# Altium schematic sheet Motor-X.SchDoc: Motor-X
size Letter; DocumentNumber: 3; SheetNumber: 5; SheetTotal: 11
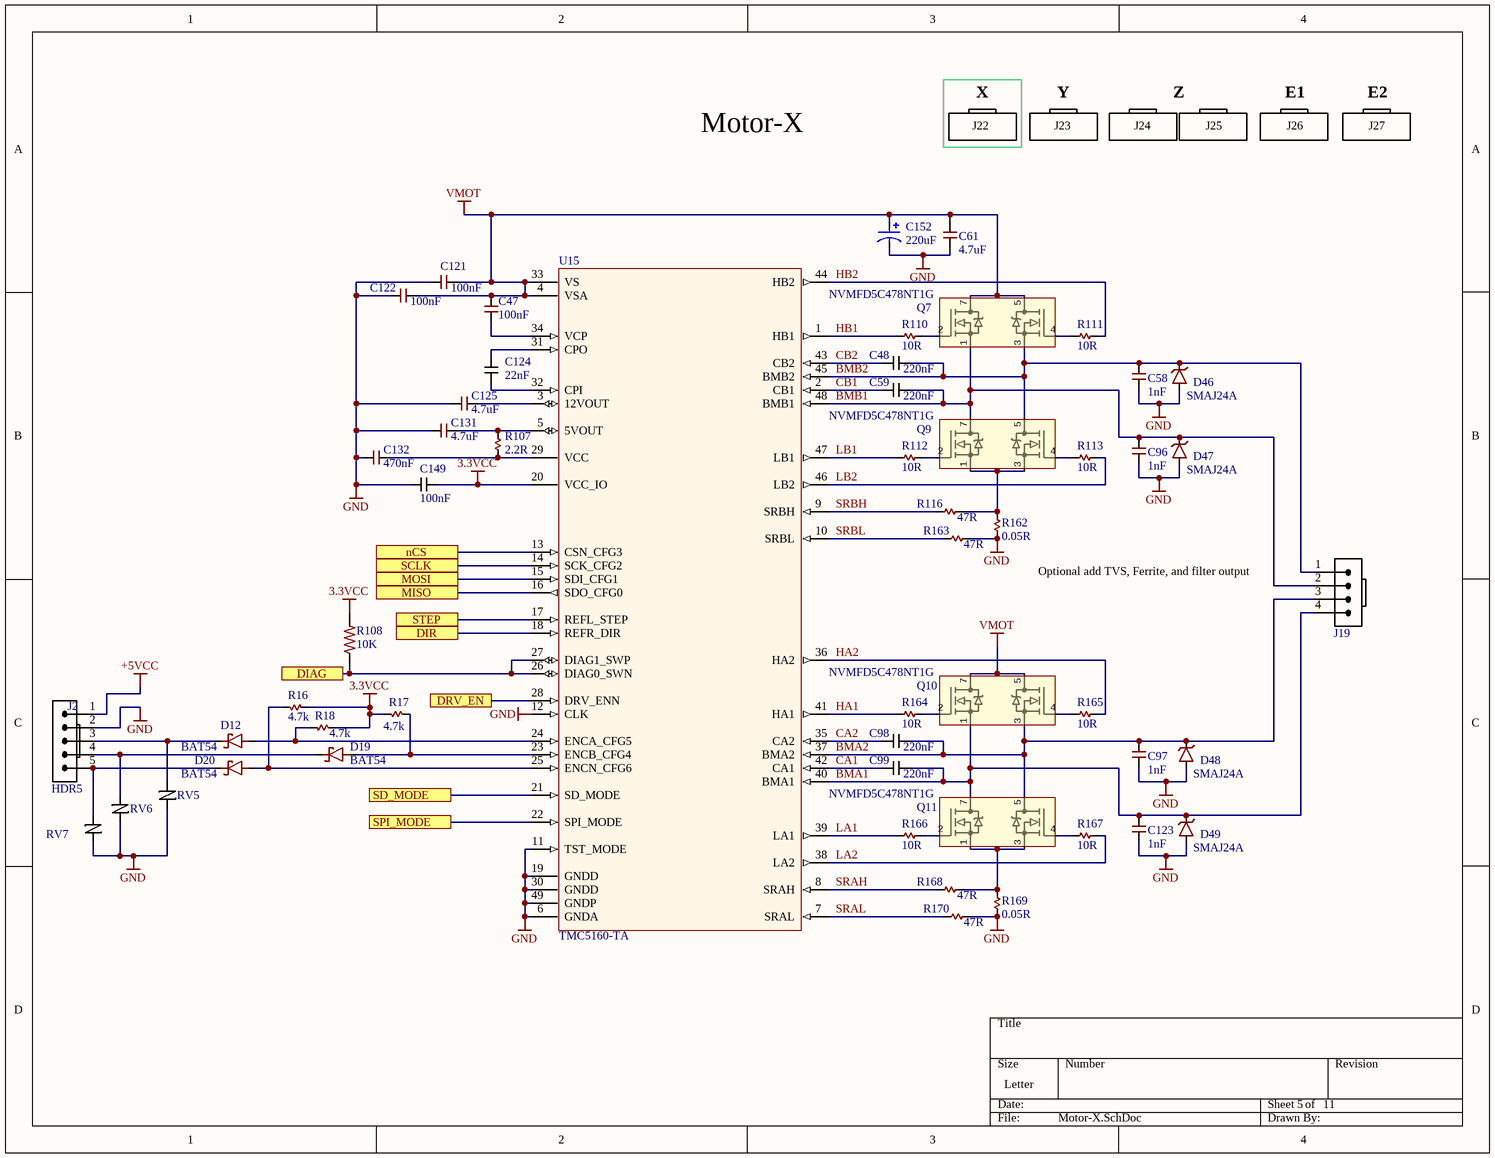
[diagram p0: Motor-X.SchDoc]

## Parts
C47  100nF  [C0603]
C48  220nF  [C0603]
C58  1nF  [C0603]
C59  220nF  [C0603]
C61  4.7uF  [C1206]
C96  1nF  [C0603]
C97  1nF  [C0603]
C98  220nF  [C0603]
C99  220nF  [C0603]
C121  100nF  [C0603]
C122  100nF  [C0603]
C123  1nF  [C0603]
C124  22nF  [C0603]
C125  4.7uF  [C1206]
C131  value 4.7uF  [C0603]  (hidden comment: 4.7uF 6.3V 0603)
C132  value 470nF  [C0402]  (hidden comment: 0402)
C149  100nF  [C0201 Large Pads]
C152  220uF  [CAP10X10]
D12  BAT54  [SOD523_IPC]
D19  BAT54  [SOD523_IPC]
D20  BAT54  [SOD523_IPC]
D46  SMAJ24A  [SMA-SM]
D47  SMAJ24A  [SMA-SM]
D48  SMAJ24A  [SMA-SM]
D49  SMAJ24A  [SMA-SM]
J2  value HDR5  [70543-04_PIN-IN-PASTE]  (hidden comment: Molex 70543-04)
J19  Molex 0705430003  [4POL254 PIN-IN-PASTE]  (value not drawn)
Q7  NVMFD5C478NT1G  [SO8FL-Dual (DFN8 5x6, 1.26P Dual Flag)]
Q9  NVMFD5C478NT1G  [SO8FL-Dual (DFN8 5x6, 1.26P Dual Flag)]
Q10  NVMFD5C478NT1G  [SO8FL-Dual (DFN8 5x6, 1.26P Dual Flag)]
Q11  NVMFD5C478NT1G  [SO8FL-Dual (DFN8 5x6, 1.26P Dual Flag)]
R16  4.7k  [R0402]
R17  4.7k  [R0402]
R18  4.7k  [R0402]
R107  2.2R  [R0402]
R108  10K  [R0402]
R110  10R  [R0402]
R111  10R  [R0402]
R112  10R  [R0402]
R113  10R  [R0402]
R116  47R  [R0402]
R162  0.05R  [R2512]
R163  47R  [R0402]
R164  10R  [R0402]
R165  10R  [R0402]
R166  10R  [R0402]
R167  10R  [R0402]
R168  47R  [R0402]
R169  0.05R  [R2512]
R170  47R  [R0402]
RV5  AVRM0603C6R8NT101N  [C0201 Large Pads]  (value not drawn)
RV6  AVRM0603C6R8NT101N  [C0201 Large Pads]  (value not drawn)
RV7  AVRM0603C6R8NT101N  [C0201 Large Pads]  (value not drawn)
U15  TMC5160-TA  [TQFP48-EP]

## Ports
DIAG, DIR, DRV_EN, MISO, MOSI, nCS, SCLK, SD_MODE, SPI_MODE, STEP

## Nets
3.3VCC: C149.2 R16.2 R17.1 R18.2 R108.2 U15.20(VCC_IO)
+5VCC: J2.1
GND: C58.1 C61.1 C96.1 C97.1 C121.1 C122.1 C123.1 C125.1 C131.1 C132.1 C149.1 C152.2 D46.A D47.A D48.A D49.A J2.2 R162.1 R163.2 R169.1 R170.2 RV5.2 RV6.2 RV7.2 U15.6(GNDA) U15.11(TST_MODE) U15.12(CLK) U15.19(GNDD) U15.30(GNDD) U15.49(GNDP)
VMOT: C47.2 C61.2 C121.2 C122.2 C152.1 Q7.5(D1) Q7.7(D2) Q10.5(D1) Q10.7(D2) U15.4(VSA) U15.33(VS)
BMA1: C99.2 C123.2 D49.K J19.4 Q10.1(S2) Q11.7(D2) U15.40(BMA1)
BMA2: C97.2 C98.2 D48.K J19.3 Q10.3(S1) Q11.5(D1) U15.37(BMA2)
BMB1: C59.2 C96.2 D47.K J19.2 Q7.1(S2) Q9.7(D2) U15.48(BMB1)
BMB2: C48.2 C58.2 D46.K J19.1 Q7.3(S1) Q9.5(D1) U15.45(BMB2)
CA1: C99.1 U15.42(CA1)
CA2: C98.1 U15.35(CA2)
CB1: C59.1 U15.2(CB1)
CB2: C48.1 U15.43(CB2)
DIAG: R108.1 U15.26(DIAG0_SWN) U15.27(DIAG1_SWP) ; port DIAG
DIR: U15.18(REFR_DIR) ; port DIR
DRV_EN: U15.28(DRV_ENN) ; port DRV_EN
HA1: R164.1 U15.41(HA1)
HA2: R165.2 U15.36(HA2)
HB1: R110.1 U15.1(HB1)
HB2: R111.2 U15.44(HB2)
LA1: R166.1 U15.39(LA1)
LA2: R167.2 U15.38(LA2)
LB1: R112.1 U15.47(LB1)
LB2: R113.2 U15.46(LB2)
MISO: U15.16(SDO_CFG0) ; port MISO
MOSI: U15.15(SDI_CFG1) ; port MOSI
nCS: U15.13(CSN_CFG3) ; port nCS
SCLK: U15.14(SCK_CFG2) ; port SCLK
SD_MODE: U15.21(SD_MODE) ; port SD_MODE
SPI_MODE: U15.22(SPI_MODE) ; port SPI_MODE
SRAH: R168.1 U15.8(SRAH)
SRAL: R170.1 U15.7(SRAL)
SRBH: R116.1 U15.9(SRBH)
SRBL: R163.1 U15.10(SRBL)
STEP: U15.17(REFL_STEP) ; port STEP
NetC47_1: C47.1 U15.34(VCP)
NetC124_1: C124.1 U15.32(CPI)
NetC124_2: C124.2 U15.31(CPO)
NetC125_2: C125.2 U15.3(12VOUT)
NetC131_2: C131.2 R107.2 U15.5(5VOUT)
NetC132_2: C132.2 R107.1 U15.29(VCC)
NetD12_A: D12.A R18.1 U15.24(ENCA_CFG5)
NetD12_K: D12.K J2.3 RV5.1
NetD19_A: D19.A R17.2 U15.23(ENCB_CFG4)
NetD19_K: D19.K J2.4 RV6.1
NetD20_A: D20.A R16.1 U15.25(ENCN_CFG6)
NetD20_K: D20.K J2.5 RV7.1
NetQ7_2: Q7.2(G2) R110.2
NetQ7_4: Q7.4(G1) R111.1
NetQ9_1: Q9.1(S2) Q9.3(S1) R116.2 R162.2
NetQ9_2: Q9.2(G2) R112.2
NetQ9_4: Q9.4(G1) R113.1
NetQ10_2: Q10.2(G2) R164.2
NetQ10_4: Q10.4(G1) R165.1
NetQ11_1: Q11.1(S2) Q11.3(S1) R168.2 R169.2
NetQ11_2: Q11.2(G2) R166.2
NetQ11_4: Q11.4(G1) R167.1

## Notes on the sheet
- X
- Y
- Z
- E1
- E2
- Motor-X
- J22
- J23
- J24
- J25
- J26
- J27
- (near J19) Optional add TVS, Ferrite, and filter output

## Library data of the parts
C47 C121 C122 = 100nF 0603 50V X7R: CAP CER 0603 100nF 50V 10% X7R; MANUFACTURER: Kemet; MANUFACTURER #: C0603C104K5RACTU; PART: 100nF 50V X7R 0603; PART DESCRIPTION: 0.10µF ±10% 50V Ceramic Capacitor X7R 0603 (1608 Metric); DISTRIBUTOR #: 399-5089-2-ND; DISTRIBUTOR: Digikey; TOLERANCE: 10%; EE_SPEC: 50V; VALUE: 100nF
C48 C59 C98 C99 = 220nF 50V X7R 0603: CAP CER 0.22UF 50V X7R 0603; MANUFACTURER: TDK; MANUFACTURER #: CGA3E3X7R1H224K080AB; PART DESCRIPTION: 0.22µF ±10% 50V Ceramic Capacitor X7R 0603 (1608 Metric); EE_SPEC: 50V X7R; VALUE: 220nF
C58 C96 C97 C123 = 1nF 50V X7R 0603: CAP CER 0603  1nF 50v 10% X7R; Manufacturer: Kemet; MANUFACTURER #: C0603C102K5RACTU; Part Description: 1000pF ±10% 50V Ceramic Capacitor X7R 0603 (1608 Metric); Tolerance: +/- 10%; VALUE: 1nF; DISTRIBUTOR #: 399-1082-2-ND; DISTRIBUTOR: Digi-Key; EE_SPEC: 1nF 50V X7R 0603; PART: 1nF
C61 C125 = 4.7uF 1206 50V X5R: CAP CER 1206 4.7uF 50V 10% X5R; MANUFACTURER: Kemet; MANUFACTURER #: C1206C475K5PACTU; PART: 4.7uF 50V X5R 1206; PART DESCRIPTION: 4.7µF ±10% 50V Ceramic Capacitor X5R 1206 (3216 Metric); DISTRIBUTOR #: 399-5507-2-ND; DISTRIBUTOR: Digikey; TOLERANCE: 10%; EE_SPEC: 50V; VALUE: 4.7uF
C124 = 22nF 100V X7R 0603: CAP CER 0.022UF 100V X7R 0603; MANUFACTURER: Kemet; MANUFACTURER #: C0603C223K1RACTU; PART DESCRIPTION: 0.022µF ±10% 100V Ceramic Capacitor X7R 0603 (1608 Metric); EE_SPEC: 100 X7R; VALUE: 22nF
C131 = 4.7uF 0603 6.3V X7R: CAP CER 4.7UF 6.3V X7R 0603; MANUFACTURER: Samsung; MANUFACTURER #: CL10B475KQ8NQNC; PART DESCRIPTION: 4.7µF ±10% 6.3V Ceramic Capacitor X7R 0603 (1608 Metric); TOLERANCE: 10%; DISTRIBUTOR #: 1276-2087-2-ND; DISTRIBUTOR: Digikey; PART: 4.7uF; EE_SPEC: 6.3V
C132 = 470nF 0402 6.3V X5R: 470nF 6.3v C0402 - GRM155R60J474KE19D; PART DESCRIPTION: 470nF ±10% 6.3V Ceramic Capacitor X5R 0402 (1005 Metric); MANUFACTURER: Murata; PART: 0.47uF 6.3V X5R 0402; TOLERANCE: 10%; EE_SPEC: 6.3V; MANUFACTURER #: GRM155R60J474KE19D; DISTRIBUTOR #: 490-3266-2-ND; DISTRIBUTOR: Digikey
C149 = 100nF 6.3V X5R 0201: CAP CER 0.1UF 6.3V 10% X5R 0201; MANUFACTURER: Samsung; MANUFACTURER #: CL03A104KQ3NNNC; VALUE: 100nF; DISTRIBUTOR: DIGI-KEY; DISTRIBUTOR #: 1276-1013-1-ND; TOLERANCE: 10%; VOLTAGE: 6.3V
C152 = 220uF Al-El 50V: CAP ALUM 220UF 20% 50V SMD; MANUFACTURER #: UCW1H221MNL1GS; MANUFACTURER: Nichicon; PART DESCRIPTION: 220µF 50V Aluminum Electrolytic Capacitors Radial, Can - SMD 7000 Hrs @ 105°C; EE_SPEC: 365mA@120Hz 730mA@100kHz 350mOhms; DISTRIBUTOR #: 493-9426-2-ND; DISTRIBUTOR: Digikey; PART: 220uF; TOLERANCE: 20%; VALUE: 220uF
D12 D19 D20 = BAT54WX: DIODE SCHOTTKY 30V 200MA SOD523; MANUFACTURER: Diodes Incorporated; MANUFACTURER #: BAT54WX-TP; PART: Schottky Diode; PART DESCRIPTION: Diode Schottky 30V 200mA (DC) Surface Mount SOD-523; TOLERANCE: -NA-; VALUE: BAT54; DISTRIBUTOR #: BAT54WX-TPTR-ND; DISTRIBUTOR: Digikey; EE_SPEC: 30V 200mA
D46-D49 = SMAJ24A: TVS DIODE 24V 38.9V SMA; Manufacturer: Bourns Inc; EE_SPEC: 24Vrs 38.9Vc; MANUFACTURER #: SMAJ24A; DISTRIBUTOR #: SMAJ24ABTR-ND; DISTRIBUTOR: Digi-Key; Part Description: TVS DIODE 24V 38.9V SMA; VALUE: SMAJ24A
J2 = CONN 5POS VERT 0.1" SHRD LOCKING PIP: 5 Positions Header, Shrouded Connector 0.100" (2.54mm) Through Hole Gold - Pin in Paste; MANUFACTURER #: 0705430004; PART: 5 Pin Conn VERT; TOLERANCE: -NA-; MANUFACTURER: Molex; PART DESCRIPTION: 5 Positions Header, Shrouded Connector 0.100" (2.54mm) Through Hole Gold; EE_SPEC: -NA-
J19 = Molex 0705430003 PIP: Molex 4 Pin Clip Connector - Pin In Paste footprint
Q7 Q9-Q11 = NVMFD5C478NT1G: 40V 17 MOHM T6 S08FL DUAL; MANUFACTURER: ON Semiconductor; PART DESCRIPTION: Mosfet Array 2 N-Channel (Dual) 40V 9.8A (Ta), 27A (Tc) 3.1W (Ta), 23W (Tc) Surface Mount 8-DFN (5x6) Dual Flag (SO8FL-Dual); TOLERANCE: -NA-; MANUFACTURER #: NVMFD5C478NT1G; DISTRIBUTOR #: NVMFD5C478NT1GOSCT-ND; DISTRIBUTOR: Digikey; VALUE: NVMFD5C478NT1G; EE_SPEC: 40V 17 MOHM
R16-R18 = 4.7k 1% 0402: RES SMD 4.7K OHM 1% 1/16W 0402; MANUFACTURER: YAGEO; MANUFACTURER #: RC0402FR-074K7L; PART DESCRIPTION: 4.7k Ohm ±1% 0.063W, 1/16W Chip Resistor 0402 (1005 Metric) Moisture Resistant Thick Film; DISTRIBUTOR #: 311-4.7KLRTR-ND; DISTRIBUTOR: Digikey; PART: 4.7k 1% 0402; TOLERANCE: 1%; EE_SPEC: 1/16W; VALUE: 4.7k
R107 = 2.2R 5% 0402: RES SMD 2.2 OHM 5% 1/16W 0402; MANUFACTURER: Yageo; MANUFACTURER #: RC0402JR-072R2L; Part Description: 2.2 Ohms ±5% 0.063W, 1/16W Chip Resistor 0402 (1005 Metric) Moisture Resistant Thick Film; Tolerance: +/- 5%; VALUE: 2.2R; EE_SPEC: 2.2R 5% 0402
R108 = RC0402FR-0710KP: RES SMD 10K OHM 1% 1/16W 0402; MANUFACTURER: Yageo; PART: 10k 1% 0402; PART DESCRIPTION: 10k Ohm ±1% 0.063W, 1/16W Chip Resistor 0402 (1005 Metric) Moisture Resistant Thick Film; VALUE: 10K; MANUFACTURER #: RC0402FR-0710KP; DISTRIBUTOR #: YAG1249TR-ND; DISTRIBUTOR: Digi-Key Electronics; TOLERANCE: 1%; EE_SPEC: 1/16W
R110-R113 R164-R167 = 10R 1% 0402: RES SMD 10 OHM 1% 1/16W 0402; MANUFACTURER: Yageo; MANUFACTURER #: RC0402FR-0710RL; PART DESCRIPTION: 10 Ohm ±1% 0.063W, 1/16W Chip Resistor 0402 (1005 Metric) Moisture Resistant Thick Film; DISTRIBUTOR #: 311-10.0LRTR-ND; DISTRIBUTOR: Digikey; PART: 10R 1% 0402; TOLERANCE: 1%; EE_SPEC: 1/16W; VALUE: 10R
R116 R163 R168 R170 = 47R 1% 0402: RES 47 OHM 1% 1/16W 0402; MANUFACTURER: Vishay Dale; MANUFACTURER #: CRCW040247R0FKEDC; Part Description: 47 Ohms ±1% 0.063W, 1/16W Chip Resistor 0402 (1005 Metric)  Thick Film; Tolerance: +/- 1%; VALUE: 47R; EE_SPEC: 47R 1% 0402
R162 R169 = 0.05R 1% 2512: RES 0.05 OHM 1% 2W 2512; MANUFACTURER: Stackpole; MANUFACTURER #: CSRN2512FK50L0; Part Description: 50 mOhms ±1% 2W Chip Resistor 2512 (6432 Metric) Current Sense Thick Film; Tolerance: +/- 1%; VALUE: 0.05R; EE_SPEC: 0.05R 1% 2512
RV5-RV7 = AVRM0603C6R8NT101N: VARISTOR 6.8V 10A 0201; MANUFACTURER: TDK; TOLERANCE: -NA-; EE_SPEC: 3.5Vso 100pF; MANUFACTURER #: AVRM0603C6R8NT101N; PART DESCRIPTION: VARISTOR 6.8V 10A 0201; VALUE: 6.8V
U15 = TMC5160-TA: IC STEPPER MOTOR DVR TQFP48-EP; MANUFACTURER: Trinamic; EE_SPEC: 60V 1/256 Step; VALUE: TMC5160-TA; MANUFACTURER #: TMC5160-TA; Part Description: IC STEPPER MOTOR DVR TQFP48-EP